# Altium schematic sheet Parallel Input.SchDoc
size A4
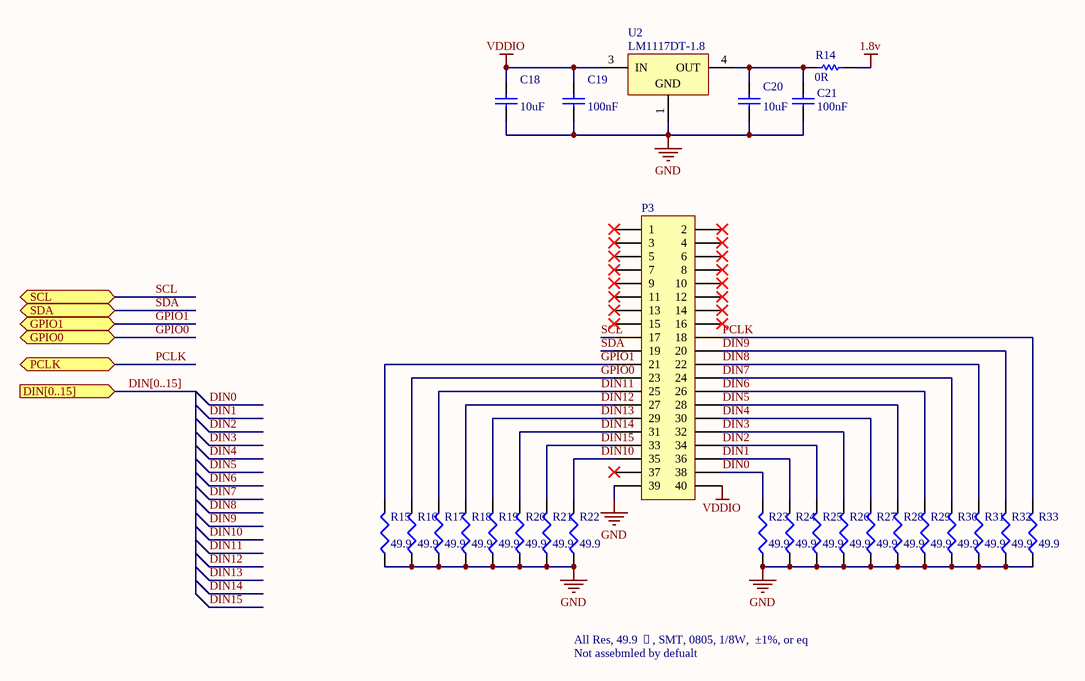
[diagram p0: Parallel Input.SchDoc]

## Parts
C18  10uF  [0805]
C19  100nF  [0603]
C20  10uF  [0805]
C21  100nF  [0603]
P3  WE-2,54mm_Box Header 61204020621  [61204020621]  (value not drawn)
R14  0R  [0805]
R15  value 49.9  [12Z-2010]  (hidden comment: Res3)
R16  value 49.9  [12Z-2010]  (hidden comment: Res3)
R17  value 49.9  [12Z-2010]  (hidden comment: Res3)
R18  value 49.9  [12Z-2010]  (hidden comment: Res3)
R19  value 49.9  [12Z-2010]  (hidden comment: Res3)
R20  value 49.9  [12Z-2010]  (hidden comment: Res3)
R21  value 49.9  [12Z-2010]  (hidden comment: Res3)
R22  value 49.9  [12Z-2010]  (hidden comment: Res3)
R23  value 49.9  [12Z-2010]  (hidden comment: Res3)
R24  value 49.9  [12Z-2010]  (hidden comment: Res3)
R25  value 49.9  [12Z-2010]  (hidden comment: Res3)
R26  value 49.9  [12Z-2010]  (hidden comment: Res3)
R27  value 49.9  [12Z-2010]  (hidden comment: Res3)
R28  value 49.9  [12Z-2010]  (hidden comment: Res3)
R29  value 49.9  [12Z-2010]  (hidden comment: Res3)
R30  value 49.9  [12Z-2010]  (hidden comment: Res3)
R31  value 49.9  [12Z-2010]  (hidden comment: Res3)
R32  value 49.9  [12Z-2010]  (hidden comment: Res3)
R33  value 49.9  [12Z-2010]  (hidden comment: Res3)
U2  LM1117DT-1.8  [TD03B_N]

## Ports
DIN[0..15] (in), GPIO0, GPIO1, PCLK, SCL, SDA

## Nets
1.8v: R14.2
GND: C18.2 C19.2 C20.2 C21.2 P3.39 R15.1 R16.1 R17.1 R18.1 R19.1 R20.1 R21.1 R22.1 R23.1 R24.1 R25.1 R26.1 R27.1 R28.1 R29.1 R30.1 R31.1 R32.1 R33.1 U2.1(GND)
VDDIO: C18.1 C19.1 P3.40 U2.3(IN)
DIN0: P3.38 R23.2
DIN1: P3.36 R24.2
DIN2: P3.34 R25.2
DIN3: P3.32 R26.2
DIN4: P3.30 R27.2
DIN5: P3.28 R28.2
DIN6: P3.26 R29.2
DIN7: P3.24 R30.2
DIN8: P3.22 R31.2
DIN9: P3.20 R32.2
DIN10: P3.35 R22.2
DIN11: P3.25 R17.2
DIN12: P3.27 R18.2
DIN13: P3.29 R19.2
DIN14: P3.31 R20.2
DIN15: P3.33 R21.2
GPIO0: P3.23 R16.2 ; port GPIO0
GPIO1: P3.21 R15.2 ; port GPIO1
PCLK: P3.18 R33.2 ; port PCLK
SCL: P3.17 ; port SCL
SDA: P3.19 ; port SDA
NetC20_1: C20.1 C21.1 R14.1 U2.4(OUT)

Not connected (* = marked no-connect by the designer): P3 1* 2* 3* 4* 5* 6* 7* 8* 9* 10* 11* 12* 13* 14* 15* 16* 37*

## Buses and harness runs
bus DIN[0..15] = port DIN[0..15]

## Notes on the sheet
- Not assebmled by defualt
- All Res, 49.9 , SMT, 0805, 1/8W,  ±1%, or eq

## Library data of the parts
C18-C21 = Cap: Capacitor; Published: 8-Jun-2000; LatestRevisionDate: 17-Jul-2002; LatestRevisionNote: Re-released for DXP Platform.; PackageReference: RAD-0.3; Publisher: Altium Limited; PackageDescription: Radial Cap, Thru-Hole; 2 Leads; 0.3 in Pin Spacing
  C18 C20: Value: 10uF
  C19 C21: Value: 100nF
P3 = WE-2,54mm_Box Header 61204020621: WR-BHD 2.54mm Male SMT Box Header; Manufacturer: W¨¹rth Elektronik eiSos GmbH; ComponentLink1 Description: Manufacturer; ComponentLink2 Description: Datasheet; NoPins: 40; Created Date: 8 May 2013; partNo: 61204020621; ComponentLink1URL: http://www.we-online.com; ComponentLink2URL: http://katalog.we-online.de/em/datasheet/6120xx20621.pdf; Created by: Karrer Zheng
R14 = Res Semi: Semiconductor Resistor; Published: 8-Jun-2010; LatestRevisionDate: 17-Jul-2002; LatestRevisionNote: Re-released for DXP Platform.; Publisher: Altium Limited; Value: 0R
R15-R33 = Res3: Resistor; Published: 8-Jun-2000; LatestRevisionDate: 29-May-2009; LatestRevisionNote: IPC-7351 Footprint Added.; Publisher: Altium Limited; PackageDescription: Chip Resistor
  R15: PackageReference: 0201
  R16-R32: PackageReference: J1-0603
  R33: PackageReference: 0805
U2 = LM1117DT-3.3: 800mA Low-Dropout Linear Regulator, 3-pin TO-252; Manufacturer: National Semiconductor; PackageTopMarking: NSUZXYTT*LM1117*DT-3.3; PowerWise: N; CompType: LDO IC; Published: 4-Dec-2008; DatasheetVersion: Apr-2006; PackageVersion: revD, Feb-2009; PackageReference: TD03B; Publisher: Altium Limited; PackageDescription: TO252, Molded, Jedec, 6.8 x 6.10 x 2.30mm Body, 3 Lead, 2.28mm Pitch, Surface Mount; Supplier 1: Farnell; Supplier Part Number 1: 9486275; Supplier 2: Farnell; Supplier Part Number 2: 1523829; PartNumber: LM1117DT-3.3; RoHS: N; PinCount: 3; Code_JEDEC: TO-252-AA; ComponentLink1Description: LM1117 Datasheet; ComponentLink1URL: http://www.national.com/ds/LM/LM1117.pdf; ComponentLink2Description: LM1117 Web Page; ComponentLink2URL: http://www.national.com/pf/LM/LM1117.html; ComponentLink3Description: TD03B Package Page; ComponentLink3URL: http://www.national.com/packaging/folders/td03b.html